# EAGLE design grillupboard (EAGLE 6.3)
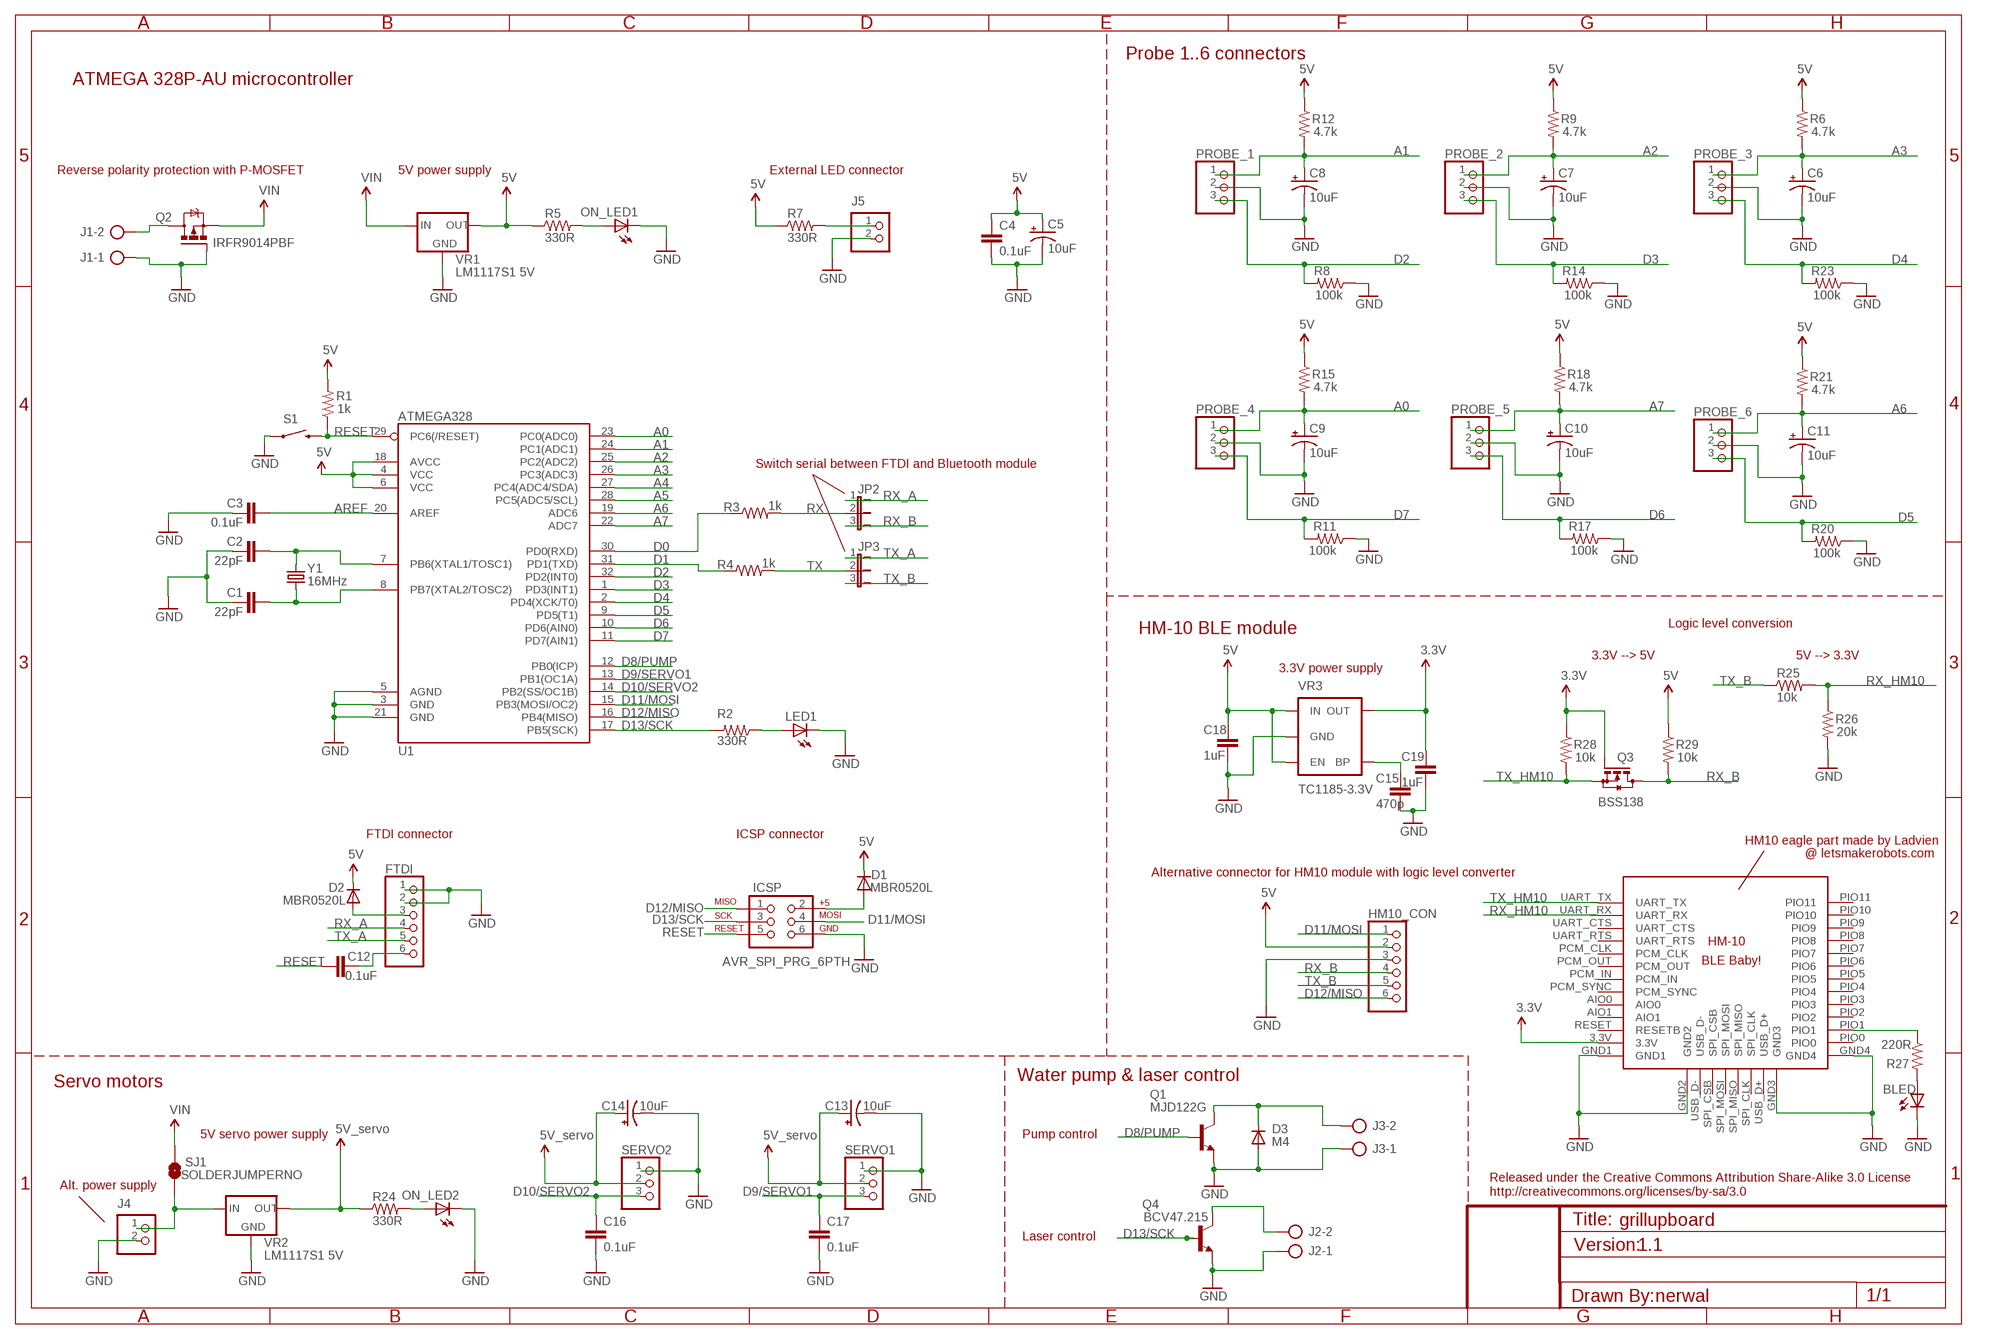
[diagram p0: schematic, sheet 1]

## Parts
BLED  LED0603  [LED-0603]
C1  22pF  CAP0805  [0805]
C2  22pF  CAP0805  [0805]
C3  0.1uF  CAP0805  [0805]
C4  0.1uF  CAP0805  [0805]
C5  10uF  CAP_POL1206  [EIA3216]
C6  10uF  CAP_POL1206  [EIA3216]
C7  10uF  CAP_POL1206  [EIA3216]
C8  10uF  CAP_POL1206  [EIA3216]
C9  10uF  CAP_POL1206  [EIA3216]
C10  10uF  CAP_POL1206  [EIA3216]
C11  10uF  CAP_POL1206  [EIA3216]
C12  0.1uF  CAP0805  [0805]
C13  10uF  CAP_POL1206  [EIA3216]
C14  10uF  CAP_POL1206  [EIA3216]
C15  470p  CAP0805  [0805]
C16  0.1uF  CAP0805  [0805]
C17  0.1uF  CAP0805  [0805]
C18  1uF  CAP0805  [0805]
C19  1uF  CAP0805  [0805]
D1  MBR0520L  MBR0520LT  [SOD123]
D2  MBR0520L  MBR0520LT  [SOD123]
D3  M4  DIODESMA  [SMA-DIODE]
FTDI  PINHD-1X6  [1X06]
HM10  RANDOM_PARTS_BLE-HM-10  [RANDOM_PARTS_BLE-HM-10]
HM10_CON  PINHD-1X6  [1X06]
ICSP  AVR_SPI_PRG_6PTH  [2X3]
J1  AK500/2-H  [AK500/2-H]
J2  AK500/2-H  [AK500/2-H]
J3  AK500/2-H  [AK500/2-H]
J4  PINHD-1X2  [1X02]
J5  PINHD-1X2  [1X02]
JP2  JP2E  [JP2]
JP3  JP2E  [JP2]
LED1  LED0603  [LED-0603]
ON_LED1  LED0603  [LED-0603]
ON_LED2  LED0603  [LED-0603]
PROBE_1  PINHD-1X3  [1X03]
PROBE_2  PINHD-1X3  [1X03]
PROBE_3  PINHD-1X3  [1X03]
PROBE_4  PINHD-1X3  [1X03]
PROBE_5  PINHD-1X3  [1X03]
PROBE_6  PINHD-1X3  [1X03]
Q1  MJD122G  MJD31  [DPAK]
Q2  IRFR9014PBF  IRFR5305  [D-PAK_TO252AA]
Q3  BSS138  BSS123  [SOT23]
Q4  BCV47.215  BCV71-NPN-SOT23-BEC  [SOT23-BEC]
R1  1k  RESISTOR0805-RES  [0805]
R2  330R  RESISTOR0805-RES  [0805]
R3  1k  RESISTOR0805-RES  [0805]
R4  1k  RESISTOR0805-RES  [0805]
R5  330R  RESISTOR0805-RES  [0805]
R6  4.7k  RESISTOR0805-RES  [0805]
R7  330R  RESISTOR0805-RES  [0805]
R8  100k  RESISTOR0805-RES  [0805]
R9  4.7k  RESISTOR0805-RES  [0805]
R11  100k  RESISTOR0805-RES  [0805]
R12  4.7k  RESISTOR0805-RES  [0805]
R14  100k  RESISTOR0805-RES  [0805]
R15  4.7k  RESISTOR0805-RES  [0805]
R17  100k  RESISTOR0805-RES  [0805]
R18  4.7k  RESISTOR0805-RES  [0805]
R20  100k  RESISTOR0805-RES  [0805]
R21  4.7k  RESISTOR0805-RES  [0805]
R23  100k  RESISTOR0805-RES  [0805]
R24  330R  RESISTOR0805-RES  [0805]
R25  10k  RESISTOR0805-RES  [0805]
R26  20k  RESISTOR0805-RES  [0805]
R27  220R  RESISTOR0805-RES  [0805]
R28  10k  RESISTOR0805-RES  [0805]
R29  10k  RESISTOR0805-RES  [0805]
S1  SWITCH-MOMENTARY-2-SMD-1101NE  [TACTILE-SWITCH-1101NE]
SERVO1  PINHD-1X3  [1X03]
SERVO2  PINHD-1X3  [1X03]
SJ1  SOLDERJUMPERNO  [SJ_2S-NO]
U1  ATMEGA328  ATMEGA168  [TQFP32-08]
VR1  LM1117S1 5V  LM1117  [SOT223]
VR2  LM1117S1 5V  LM1117  [SOT223]
VR3  TC1185-3.3V  V_REG_LDOSMD  [SOT23-5]
Y1  16MHz  CRYSTALHC49S  [HC49/S]

## Nets
3.3V: C19.1 HM10.3.3V Q3.1(G) R28.1 VR3.5(OUT)
5V: C4.1 C5.A(+) C18.1 D1.C D2.C HM10_CON.2 R1.2 R5.1 R6.1 R7.1 R9.1 R12.1 R15.1 R18.1 R21.1 R29.1 U1.4(VCC) U1.6(VCC) U1.18(AVCC) VR1.2(OUT) VR3.1(IN) VR3.3(EN)
A0: C9.A(+) PROBE_4.1 R15.2 U1.23(PC0(ADC0))
A1: C8.A(+) PROBE_1.1 R12.2 U1.24(PC1(ADC1))
A2: C7.A(+) PROBE_2.1 R9.2 U1.25(PC2(ADC2))
A3: C6.A(+) PROBE_3.1 R6.2 U1.26(PC3(ADC3))
A4: U1.27(PC4(ADC4/SDA))
A5: U1.28(PC5(ADC5/SCL))
A6: C11.A(+) PROBE_6.1 R21.2 U1.19(ADC6)
A7: C10.A(+) PROBE_5.1 R18.2 U1.22(ADC7)
AREF: C3.2 U1.20(AREF)
D0: R3.1 U1.30(PD0(RXD))
D1: R4.1 U1.31(PD1(TXD))
D2: PROBE_1.3 R8.2 U1.32(PD2(INT0))
D3: PROBE_2.3 R14.2 U1.1(PD3(INT1))
D4: PROBE_3.3 R23.2 U1.2(PD4(XCK/T0))
D5: PROBE_6.3 R20.2 U1.9(PD5(T1))
D6: PROBE_5.3 R17.2 U1.10(PD6(AIN0))
D7: PROBE_4.3 R11.2 U1.11(PD7(AIN1))
D8/PUMP: Q1.1(B) U1.12(PB0(ICP))
D9/SERVO1: C17.1 SERVO1.3 U1.13(PB1(OC1A))
D10/SERVO2: C16.1 SERVO2.3 U1.14(PB2(SS/OC1B))
D11/MOSI: HM10_CON.1 ICSP.4 U1.15(PB3(MOSI/OC2))
D12/MISO: HM10_CON.6 ICSP.1 U1.16(PB4(MISO))
D13/SCK: ICSP.3 Q4.B R2.2 U1.17(PB5(SCK))
GND: BLED.C C1.1 C2.1 C3.1 C4.2 C5.C(-) C6.C(-) C7.C(-) C8.C(-) C9.C(-) C10.C(-) C11.C(-) C13.C(-) C14.C(-) C15.2 C16.2 C17.2 C18.2 C19.2 D3.A FTDI.1 FTDI.2 HM10.GND1 HM10.GND2 HM10.GND3 HM10.GND4 HM10_CON.3 ICSP.6 J1.1 J2.1 J3.1 J4.2 J5.2 LED1.C ON_LED1.C ON_LED2.C PROBE_1.2 PROBE_2.2 PROBE_3.2 PROBE_4.2 PROBE_5.2 PROBE_6.2 Q1.3(E) Q2.1(G) Q4.E R8.1 R11.1 R14.1 R17.1 R20.1 R23.1 R26.2 S1.P$1 SERVO1.1 SERVO2.1 U1.3(GND) U1.5(AGND) U1.21(GND) VR1.1(GND) VR2.1(GND) VR3.2(GND)
N$1: C2.2 U1.7(PB6(XTAL1/TOSC1)) Y1.2
N$2: C1.2 U1.8(PB7(XTAL2/TOSC2)) Y1.1
N$3: ON_LED1.A R5.2
N$4: D1.A ICSP.2
N$5: LED1.A R2.1
N$6: ON_LED2.A R24.2
N$8: D3.C J3.2 Q1.4(C)
N$9: D2.A FTDI.3
N$10: J1.2 Q2.4(D)
N$11: J4.1 SJ1.1 VR2.3(IN)
N$12: C12.2 FTDI.6
N$13: J2.2 Q4.C
N$15: HM10.PIO1 R27.1
N$16: BLED.A R27.2
N$17: C15.1 VR3.4(BP)
N$19: J5.1 R7.2
RESET: C12.1 ICSP.5 R1.1 S1.P$2 U1.29(PC6(/RESET))
RX: JP2.2 R3.2
RX_A: FTDI.4 JP2.1
RX_B: HM10_CON.4 JP2.3 Q3.3(D) R29.2
RX_HM10: HM10.UART_RX R25.2 R26.1
TX: JP3.2 R4.2
TX_A: FTDI.5 JP3.1
TX_B: HM10_CON.5 JP3.3 R25.1
TX_HM10: HM10.UART_TX Q3.2(S) R28.2
VCC: C13.A(+) C14.A(+) R24.1 SERVO1.2 SERVO2.2 VR2.2(OUT) ; supply symbol labelled 5V_servo
VIN: Q2.3(S) SJ1.2 VR1.3(IN)
Unconnected: HM10.AIO0 HM10.AIO1 HM10.PCM_CLK HM10.PCM_IN HM10.PCM_OUT HM10.PCM_SYNC HM10.PIO0 HM10.PIO2 HM10.PIO3 HM10.PIO4 HM10.PIO5 HM10.PIO6 HM10.PIO7 HM10.PIO8 HM10.PIO9 HM10.PIO10 HM10.PIO11 HM10.RESET(RESETB) HM10.SPI_CLK HM10.SPI_CSB HM10.SPI_MISO HM10.SPI_MOSI HM10.UART_CTS HM10.UART_RTS HM10.USB_D+ HM10.USB_D-

## Notes on the sheet
- Probe 1..6 connectors
- ATMEGA 328P-AU microcontroller
- Reverse polarity protection with P-MOSFET | 5V power supply | External LED connector
- Switch serial between FTDI and Bluetooth module
- Logic level conversion
- HM-10 BLE module
- 3.3V --> 5V | 5V --> 3.3V
- 3.3V power supply
- FTDI connector | ICSP connector
- HM10 eagle part made by Ladvien
- @ letsmakerobots.com
- Alternative connector for HM10 module with logic level converter
- Water pump & laser control
- Servo motors
- 5V servo power supply | Pump control
- Released under the Creative Commons Attribution Share-Alike 3.0 License
- Alt. power supply
- http://creativecommons.org/licenses/by-sa/3.0
- Laser control
- 1.1
- nerwal

## Library data of the parts
BLED LED1 ON_LED1 ON_LED2 = SparkFun-LED:LED: LEDs Standard schematic elements and footprints for 5mm, 3mm, 1206, and 0603 sized LEDs. 5mm - Spark Fun Electronics SKU : COM-00529 (and others)
C1-C4 C12 C15-C19 = SparkFun-Passives:CAP: Capacitor Standard 0603 ceramic capacitor, and 0.1" leaded capacitor.
C5-C11 C13 C14 = SparkFun-Passives:CAP_POL: Capacitor Polarized These are standard SMD and PTH capacitors. Normally 10uF, 47uF, and 100uF in electrolytic and tantalum varieties. Always verify the external diameter of the through hole cap, it varies with capacity, voltage, and manufacturer. The EIA devices should be standard.
D1 D2 = diode:MBR0520LT: SCHOTTKY BARRIER RECTIFIER Source: http://onsemi.com .. MBR0520LT1-D.pdf
D3 = SparkFun-DiscreteSemi:DIODE: Diode These are standard reverse protection diodes and small signal diodes. SMA package can handle up to about 1A. SOD-323 can handle about 200mA. What the SOD-323 package when ordering, there are some mfgs out there that are 5-pin packages.
FTDI HM10_CON = pinhead:PINHD-1X6: PIN HEADER
HM10 = BLE_--_HM-10_--_Breakout_v0.9.9:RANDOM_PARTS_BLE-HM-10
ICSP = SparkFun-Connectors:AVR_SPI_PRG_6: AVR ISP 6 Pin This is the reduced ISP connector for AVR programming. Common on Arduino. This footprint will take up less PCB space and can be used with a 10-pin to 6-pin adapter such as SKU: BOB-08508
J1-J3 = con-ptr500:AK500/2-H: CONNECTOR Aug. 2004 / PTR Meßtechnik: Die Bezeichnung der Serie AK505 wurde geändert. Es handelt sich hierbei um AK500 in horizontaler Ausführung.; OC_FARNELL: unknown; OC_NEWARK: unknown
J4 J5 = pinhead:PINHD-1X2: PIN HEADER
JP2 JP3 = jumper:JP2E: JUMPER
PROBE_1-PROBE_6 SERVO1 SERVO2 = pinhead:PINHD-1X3: PIN HEADER
Q1 = transistor:MJD31*: Complementary Power Transistors
Q2 = transistor-power:IRF?5305: HEXFET Power MOSFET Source: http://www.irf.com/product-info/datasheets/data/irfr5305pbf.pdf
Q3 = transistor-small-signal:BSS123: N-CHANNEL MOS FET
Q4 = transistor:*-NPN-: NPN Transistror BF959 corrected 2008.03.06
R1-R9 R11 R12 R14 R15 R17 R18 R20 R21 R23-R29 = SparkFun-Passives:RESISTOR: Resistor Basic schematic elements and footprints for 0603, 1206, and PTH resistors.
S1 = SparkFun-Electromechanical:SWITCH-MOMENTARY-2: Various NO switches- pushbuttons, reed, etc
SJ1 = SparkFun-Passives:SOLDERJUMPER: Solder Jumper Standard SMD solder jumper. Used to automate production. Two varients : Normally Open and Normally Closed are the same, but have different paste layers. NC will have a large amount of paste and should jumper during reflow.
U1 = SparkFun-DigitalIC:ATMEGA168: Atmel 32-pin 8-bit micro, 16k flash.
VR1 VR2 = v-reg-3:LM1117
VR3 = SparkFun-PowerIC:V_REG_LDO: Voltage Regulator LDO Standard 150mA LDO voltage regulator in SOT-23 layout. Micrel part MIC5205. BP (by-pass) pin is used to lower output noise with 470pF cap.
Y1 = crystal:CRYSTAL: CRYSTAL; OC_FARNELL: 1667008; OC_NEWARK: unknown

## Board
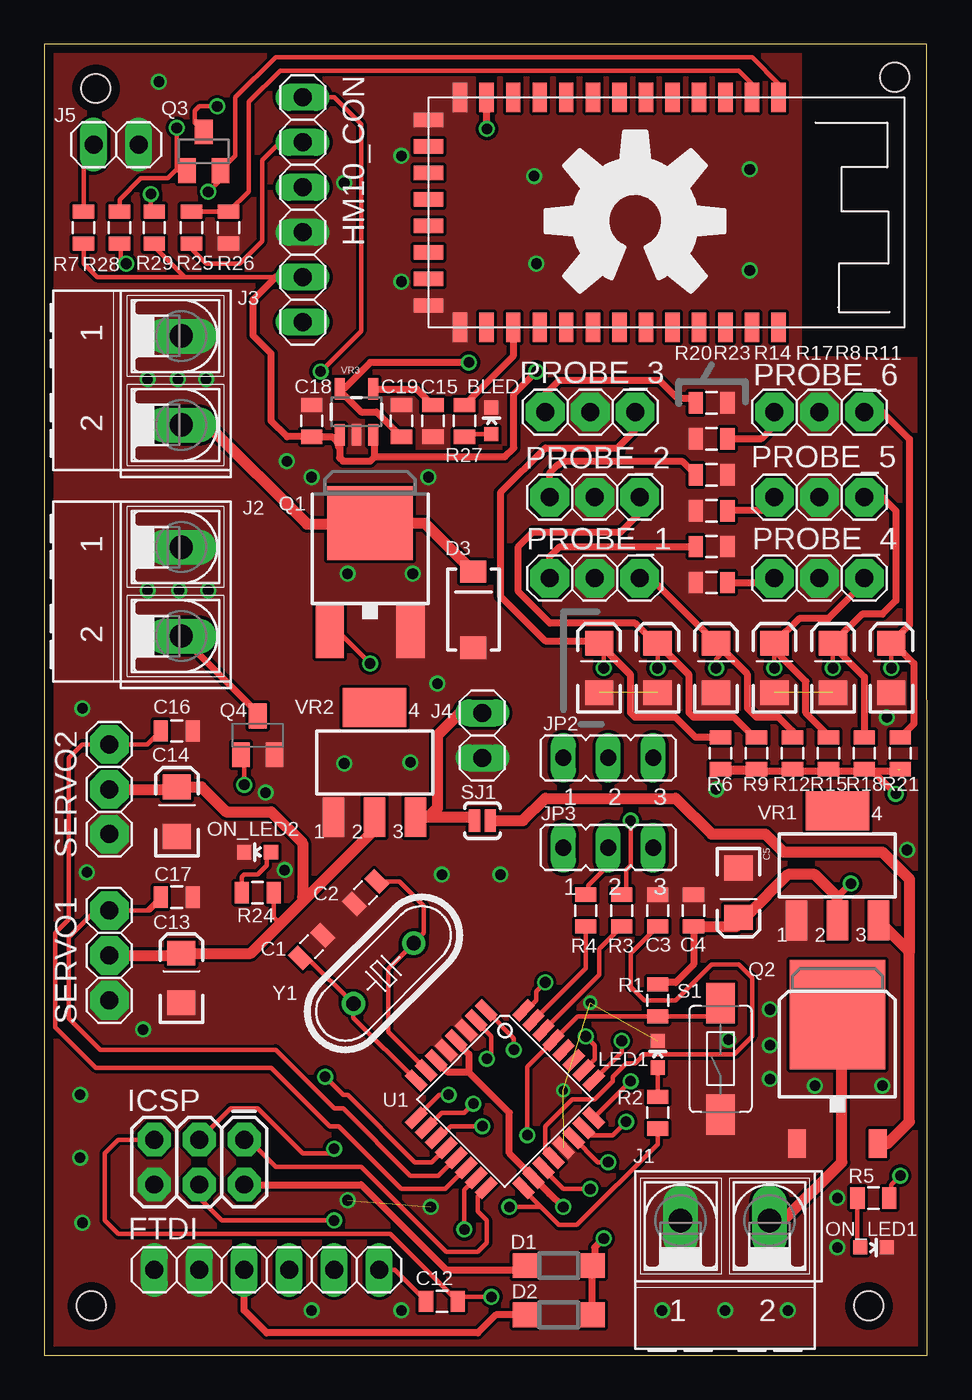
[diagram p1: board, top side]
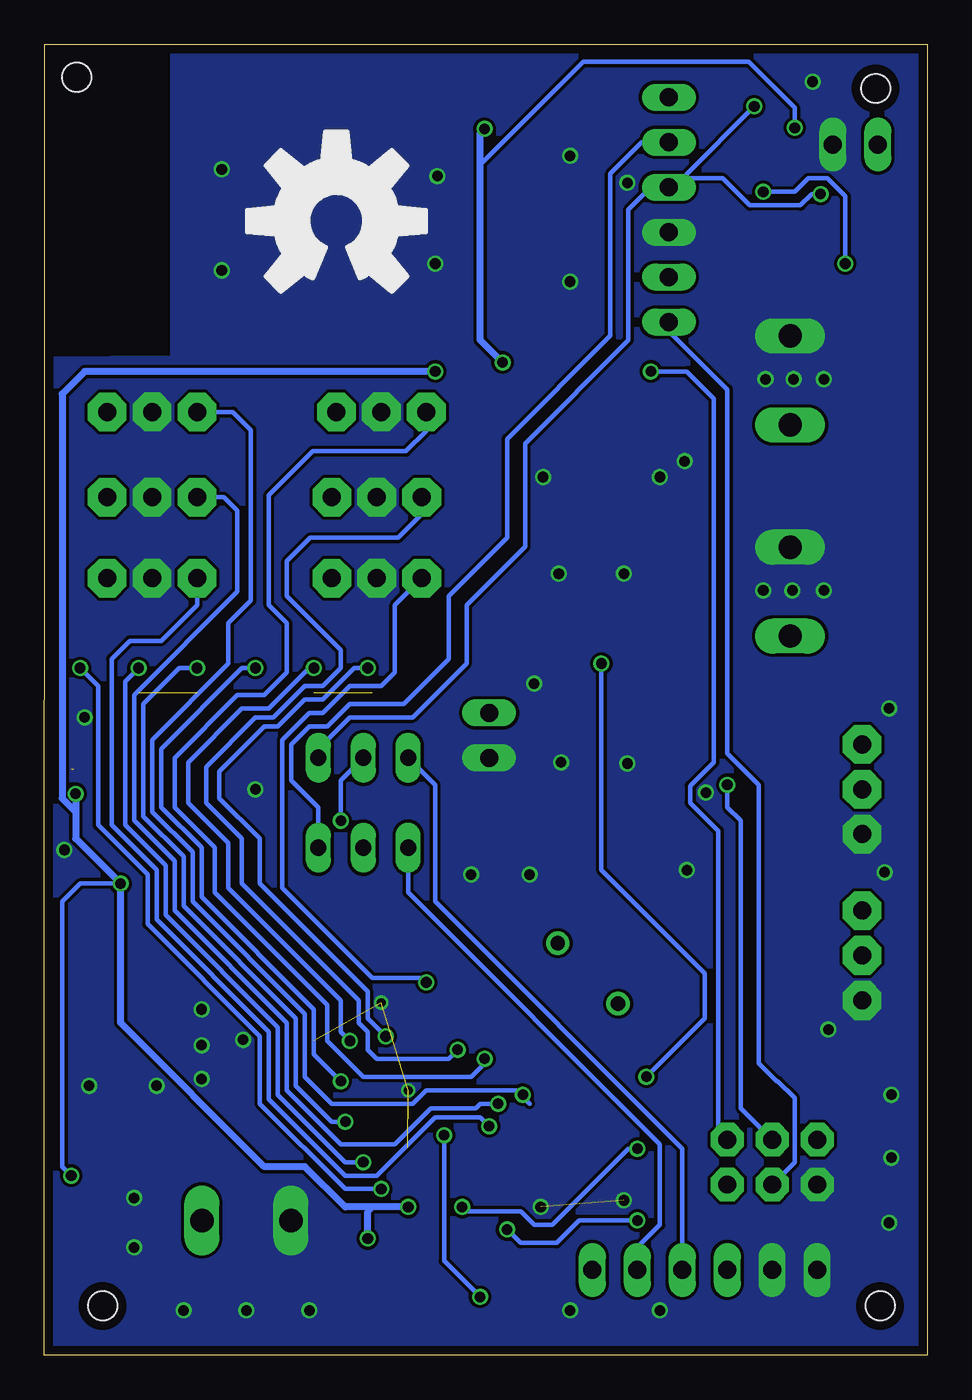
[diagram p2: board, bottom side, seen from below]

Size 49.91 x 74.13 mm. Coordinates in mm from the lower left corner, seen from the top.
Outline: 0,0 49.91,0 49.89,74.13 0,74.13 0,0
Copper layers (1*16): Top 0.035mm / dielectric 1.5mm / Bottom 0.035mm
Design rules: minimum track width 7mil, minimum drill 12mil, track to track 7mil, track to pad 7mil, pad to pad 7mil, via to via 7mil, smd to smd 0mil, copper to edge 20mil, drill to drill 10mil, minimum pad ring 10mil, minimum via ring 6mil, stop-mask expansion 2mil, vias tented up to drill 25mil, thermal gap 10mil
Holes 1.65 mm at 2.67,2.79 46.61,2.79 2.92,71.63 48.07,72.26
tRestrict: area 1.5,1.7 to 3.8,3.9; area 45.5,1.7 to 47.8,3.9; area 1.8,70.5 to 4.1,72.8; area 46.9,71.1 to 49.2,73.4
bRestrict: area 1.5,1.7 to 3.8,3.9; area 45.5,1.7 to 47.8,3.9; area 1.8,70.5 to 4.1,72.8; area 46.9,71.1 to 49.2,73.4

### Footprints (pad centres in the part's own frame; a part is rotated, then mirrored left to right if it is on the bottom)
LED-0603 = smd 0.8 x 0.8: A 0,-0.75; C 0,0.75
0805 = smd 0.8 x 1.2: 1 -0.9,0; 2 0.9,0
EIA3216 = smd 1.4 x 1.6: A 1.4,0; C -1.4,0
SOD123 = smd 1.4 x 1.4: A 1.9,0; C -1.9,0
SMA-DIODE = smd 1.27 x 1.47: A -2.15,0; C 2.15,0
1X06 = drill 1.016 long: 1 -6.35,0; 2 -3.81,0; 3 -1.27,0; 4 1.27,0; 5 3.81,0; 6 6.35,0
RANDOM_PARTS_BLE-HM-10 = smd 1.676 x 0.813: 3.3V 0,3.29; AIO0 0,7.79; AIO1 0,6.29; GND1 0,1.79; GND4 13,1.79; PCM_CLK 0,13.79; PCM_IN 0,10.79; PCM_OUT 0,12.29; PCM_SYNC 0,9.29; PIO0 13,3.29; PIO1 13,4.79; PIO2 13,6.29; PIO3 13,7.79; PIO4 13,9.29; PIO5 13,10.79; PIO6 13,12.29; PIO7 13,13.79; PIO8 13,15.29; PIO9 13,16.79; PIO10 13,18.29; PIO11 13,19.79; RESET 0,4.79; UART_CTS 0,16.79; UART_RTS 0,15.29; UART_RX 0,18.29; UART_TX 0,19.79 | smd 0.813 x 1.676: GND2 1.27,0; GND3 11.77,0; SPI_CLK 8.77,0; SPI_CSB 4.27,0; SPI_MISO 7.27,0; SPI_MOSI 5.77,0; USB_D+ 10.27,0; USB_D- 2.77,0
2X3 = drill 1.016 pad 1.88 octagon: 1 0,0; 2 0,2.54; 3 2.54,0; 4 2.54,2.54; 5 5.08,0; 6 5.08,2.54
AK500/2-H = drill 1.321 long: 1 -2.515,0; 2 2.515,0
1X02 = drill 1.016 long: 1 -1.27,0; 2 1.27,0
JP2 = drill 0.914 long: 1 -2.54,0; 2 0,0; 3 2.54,0
1X03 = drill 1.016 pad 2.184 octagon: 1 -2.54,0; 2 0,0; 3 2.54,0
DPAK = smd 1.6 x 3: 1 -2.28,-4.04; 3 2.28,-4.04 | smd 4.826 x 4.191: 4 0,2.096
D-PAK_TO252AA = smd 1 x 1.6: 1 -2.28,-4.8; 3 2.28,-4.8 | smd 5.4 x 6.2: 4 0,2.5
SOT23 = smd 1 x 1.4: 1 -0.95,-1.1; 2 0.95,-1.1; 3 0,1.1
SOT23-BEC = smd 1 x 1.4: B -0.95,-1.1; C 0,1.1; E 0.95,-1.1
TACTILE-SWITCH-1101NE = smd 2.3 x 1.6: P$1 -3.15,0; P$2 3.15,0
SJ_2S-NO = smd 0.635 x 1.27: 1 -0.45,0; 2 0.45,0
TQFP32-08 = smd 1.27 x 0.559: 1 -4.293,2.8; 2 -4.293,2; 3 -4.293,1.2; 4 -4.293,0.4; 5 -4.293,-0.4; 6 -4.293,-1.2; 7 -4.293,-2; 8 -4.293,-2.8; 17 4.293,-2.8; 18 4.293,-2; 19 4.293,-1.2; 20 4.293,-0.4; 21 4.293,0.4; 22 4.293,1.2; 23 4.293,2; 24 4.293,2.8 | smd 0.559 x 1.27: 9 -2.8,-4.293; 10 -2,-4.293; 11 -1.2,-4.293; 12 -0.4,-4.293; 13 0.4,-4.293; 14 1.2,-4.293; 15 2,-4.293; 16 2.8,-4.293; 25 2.8,4.293; 26 2,4.293; 27 1.2,4.293; 28 0.4,4.293; 29 -0.4,4.293; 30 -1.2,4.293; 31 -2,4.293; 32 -2.8,4.293
SOT223 = smd 1.219 x 2.235: 1 -2.311,-3.099; 2 0,-3.099; 3 2.311,-3.099 | smd 3.6 x 2.2: 4 0,3.099
SOT23-5 = smd 0.55 x 1.2: 1 -0.95,-1.3; 2 0,-1.3; 3 0.95,-1.3; 4 0.95,1.3; 5 -0.95,1.3
HC49/S = drill 0.813: 1 -2.413,0; 2 2.413,0

### Placement (x,y rotation side)
BLED  25.27,52.83 0 top
C1  15.11,23.11 225 top
C2  18.16,26.16 45 top
C3  34.67,25.15 270 top
C4  36.7,25.15 90 top
C5  39.24,26.16 270 top
C6  31.37,38.86 90 top
C7  34.67,38.86 90 top
C8  37.97,38.86 90 top
C9  41.27,38.86 90 top
C10  44.58,38.86 90 top
C11  47.88,38.86 90 top
C12  22.48,3.05 180 top
C13  7.75,21.34 90 top
C14  7.49,30.73 90 top
C15  21.97,52.83 270 top
C16  7.49,35.31 0 top
C17  7.49,25.91 0 top
C18  15.11,52.83 90 top
C19  20.19,52.83 90 top
D1  29.08,5.08 180 top
D2  29.08,2.29 180 top
D3  24.26,42.16 90 top
FTDI  12.57,4.83 0 top
HM10  21.72,71.12 270 top
HM10_CON  14.6,64.77 90 top
ICSP  11.3,12.19 180 top
J1  38.48,7.62 0 top
J2  7.75,43.18 270 top
J3  7.75,55.12 270 top
J4  24.77,35.05 270 top
J5  4.06,68.45 0 top
JP2  31.88,33.78 0 top
JP3  31.88,28.7 0 top
LED1  34.67,17.02 0 top
ON_LED1  46.86,6.1 270 top
ON_LED2  12.06,28.45 90 top
PROBE_1  31.12,43.94 180 top
PROBE_2  31.12,48.51 180 top
PROBE_3  30.86,53.34 180 top
PROBE_4  43.81,43.94 180 top
PROBE_5  43.81,48.51 180 top
PROBE_6  43.81,53.34 180 top
Q1  18.42,44.96 0 top
Q2  44.83,16.76 0 top
Q3  9.02,68.07 0 top
Q4  12.06,35.05 0 top
R1  34.67,20.07 90 top
R2  34.67,13.72 270 top
R3  32.64,25.15 90 top
R4  30.61,25.15 90 top
R5  46.86,8.89 180 top
R6  38.23,34.04 90 top
R7  2.22,63.75 90 top
R8  37.72,45.72 180 top
R9  40.26,34.04 90 top
R11  37.72,43.69 0 top
R12  42.29,34.04 90 top
R14  37.72,49.78 180 top
R15  44.32,34.04 90 top
R17  37.72,47.75 0 top
R18  46.35,34.04 90 top
R20  37.72,51.82 0 top
R21  48.39,34.04 90 top
R23  37.72,53.85 180 top
R24  12.06,26.16 180 top
R25  8.32,63.75 90 top
R26  10.41,63.75 270 top
R27  23.75,52.83 270 top
R28  4.25,63.75 270 top
R29  6.22,63.75 90 top
S1  38.23,16.76 90 top
SERVO1  3.68,22.61 90 top
SERVO2  3.68,32 90 top
SJ1  24.77,30.23 0 top
U1  26.04,14.48 315 top
VR1  44.83,27.69 0 top
VR2  18.67,33.53 0 top
VR3  17.65,53.34 0 top
Y1  19.18,21.59 45 top

### Tracks (layer width: path | path; a pad name or v marks a point on that pad's centre or on a via)
3.3V  (via drill 0.6)
  Top 0.254: Q3.1 7.58,66.97 7.49,67.06 | 7.49,67.06 v7.49,69.41 | R28.1 4.25,65.34 5.46,66.55 6.99,66.55 7.49,67.06
  Top 0.406: v25.02,69.34 25.02,71.11 HM10.3.3V | v24,56.13 18.42,56.13 16.92,54.64 VR3.5 | 16.64,54.71 VR3.5 | C19.1 18.79,53.34 17.91,53.34 16.7,54.54 VR3.5
  Bottom 0.254: 25.27,67.31 19.43,73.15 10.1,73.15 7.49,70.55 v7.49,69.41
  Bottom 0.406: v25.02,69.34 25.27,69.09 25.27,67.31 25.27,57.4 v24,56.13
5V  (via drill 0.6)  (1 unrouted)
  Top 0.254: v48.39,10.16 47.88,9.65 47.88,9.01 R5.1 | R29.1 6.35,62.55 7.94,60.96 | 13.59,60.96 HM10_CON.2 7.94,60.96 | R7.1 2.22,61.72 2.98,60.96 7.94,60.96
  Top 0.406: 44.83,25.91 v45.59,26.67 | C4.1 36.7,22.1 35.69,21.08 34.79,21.08 R1.2 | 22.15,16.58 U1.6 22.81,16 24,16 | U1.4 23.28,17.74 24,17.02 24,16 | D2.C D1.C 31.12,5.21 31.12,6.1 v31.62,6.6 | VR3.1 16.7,51.31 | 16.7,51.31 16.7,50.73 16.89,50.55 18.42,50.55 18.67,50.8 | 18.67,50.8 18.67,51.97 VR3.3 | 16.7,51.31 16.64,51.37 16.64,51.56 16.27,51.93 C18.1 13.73,51.93 12.83,52.83 12.83,56.64 11.81,57.66 11.81,59.69 13.08,60.96 HM10_CON.2 | v29.34,8.38 28.54,9.14 U1.18 27.3,10.38 27.3,10.41 26.29,11.43 26.29,13.72 24,16 | 48.25,33.14 48.13,33.02 46.86,33.02 | 46.86,33.02 v48.13,31.75 | 46.86,33.02 46.47,33.02 R18.1 46.22,33.14 46.1,33.02 44.44,33.02 R15.1 44.32,33.02 42.41,33.02 | 42.41,33.02 38.34,33.02 R6.1 R9.1 | 42.41,33.02 R12.1 | 18.67,50.8 26.04,50.8 26.54,51.31 26.54,54.36 v27.81,55.63
  Top 0.61: VR1.2 44.83,25.91 43.56,27.18 42.04,27.18 39.75,24.89 | 39.75,24.89 39.37,24.89 C5.A | C4.1 39.1,24.25 39.75,24.89
  Bottom 0.254: v45.59,26.67 47.88,26.67 48.89,25.65 48.89,10.67 v48.39,10.16
  Bottom 0.406: v29.34,8.38 31.37,8.38 | v31.62,6.6 31.62,8.13 31.37,8.38 | v48.13,31.75 48.13,30.73 | 48.13,30.73 48.13,29.21 v45.59,26.67 45.59,18.8 37.46,10.67 35.18,10.67 32.89,8.38 31.37,8.38 | v27.81,55.63 47.62,55.63 48.89,54.36 48.89,31.5 48.13,30.73
A0  (via drill 0.6)
  Top 0.254: 41.27,39.88 v41.27,38.86 | v32.89,13.21 32.13,12.45 30.89,12.45 U1.23
  Top 0.406: PROBE_4.1 46.35,43.69 44.32,41.66 42.67,41.66 C9.A 41.27,39.88 43.05,38.1 43.05,36.32 44.32,35.05 R15.2
  Bottom 0.254: v41.27,38.86 42.29,38.86 44.32,36.83 44.32,30.48 42.04,28.19 42.04,25.4 35.69,19.05 35.69,15.24 33.65,13.21 v32.89,13.21
A1  (via drill 0.6)
  Top 0.254: 31.05,13.65 U1.24 33.12,15.49 v33.15,15.49 | 39.75,36.58 39.75,38.61 38.48,39.88 38.42,39.82 37.97,39.37 v37.97,38.86
  Top 0.406: R12.2 42.29,35.31 41.53,36.07 40.26,36.07 39.75,36.58 39.75,38.48 38.42,39.82 C8.A 36.07,42.16 34.29,43.94 PROBE_1.1
  Bottom 0.254: v37.97,38.86 38.73,38.86 43.31,34.29 43.31,30.99 41.02,28.7 41.02,25.91 34.67,19.56 34.67,17.02 v33.15,15.49
A2  (via drill 0.6)
  Top 0.254: 34.67,40.13 C7.A | 36.45,36.32 36.45,38.35 34.67,40.13 | 34.67,40.13 v34.67,38.86 | v32.64,17.78 32.64,17.12 U1.25
  Top 0.406: R9.2 40.12,34.94 38.99,36.07 36.7,36.07 36.45,36.32 36.45,38.48 C7.A 34.54,40.26 33.4,41.4 28.58,41.4 26.8,43.18 26.8,45.72 27.62,46.55 32.58,46.55 33.65,47.62 PROBE_2.1
  Bottom 0.254: v32.64,17.78 33.15,18.29 33.15,20.07 39.5,26.42 39.5,28.96 41.78,31.24 41.78,33.53 38.73,36.58 37.21,36.58 34.92,38.86 v34.67,38.86
A3  (via drill 0.6)
  Top 0.254: 30.48,16.13 U1.26 31.12,16.73 31.12,17.53 v30.61,18.03 | 30.86,40.39 31.62,39.62 v31.62,38.86 31.62,39.88 33.15,38.35 33.15,36.32
  Top 0.406: R6.2 36.82,34.94 35.69,36.07 33.4,36.07 33.15,36.32 33.15,38.48 C6.A 31.25,40.39 30.86,40.39 28.32,40.39 25.78,42.93 25.78,48.77 28.32,51.31 32.38,51.31 33.4,52.32 PROBE_3.1
  Bottom 0.254: v30.61,18.03 31.62,19.05 31.62,20.57 37.72,26.67 37.72,29.21 40,31.5 40,33.02 37.46,35.56 36.7,35.56 35.18,37.08 34.16,37.08 32.38,38.86 v31.62,38.86
A6  (via drill 0.6)
  Top 0.254: U1.19 28.22,10.51 29.34,9.4 v30.86,9.4 | v47.88,38.86 C11.A
  Top 0.406: PROBE_6.1 47.37,53.34 48.89,51.82 48.89,41.28 C11.A 48,40.26 49.15,39.12 49.15,35.7 R21.2
  Bottom 0.254: v47.88,38.86 46.86,37.85 46.86,29.97 44.07,27.18 44.07,24.38 37.72,18.03 37.72,14.22 32.89,9.4 v30.86,9.4
A7  (via drill 0.6)
  Top 0.254: 30,12.29 U1.22 31.29,10.92 v31.88,10.92 | 44.58,40.13 v44.58,38.86
  Top 0.406: PROBE_5.1 47.37,48.51 48.13,47.75 48.13,42.67 47.37,41.91 46.22,41.91 C10.A 44.58,40.13 46.35,38.35 R18.2
  Bottom 0.254: v44.58,38.86 45.34,38.1 45.34,29.97 43.05,27.69 43.05,24.89 36.7,18.54 36.7,14.73 32.89,10.92 v31.88,10.92
AREF
  Top 0.254: 28.85,11.16 U1.20 28.59,11.16 28.32,11.43 28.32,12.95 29.85,14.48 31.12,14.48 32.13,15.49 32.13,15.75 32.89,16.51 33.4,16.51 33.91,17.02 38.99,17.02 40,18.03 40,21.34 39.24,22.1 37.72,22.1 35.69,20.07 33.91,20.07 33.15,20.83 33.15,22.72 C3.2
D0
  Top 0.254: 32.25,24.25 R3.1 31.37,22.98 31.37,21.51 U1.30
D1
  Top 0.254: R4.1 30.61,21.88 U1.31
D2  (via drill 0.6)
  Top 0.254: U1.32 27.24,19.49 27.81,20.07 27.81,20.57 v28.32,21.08
  Top 0.406: PROBE_1.3 28.58,45.15 29.15,45.72 R8.2
  Bottom 0.254: v28.32,21.08 28.58,21.34 31.37,21.34 36.45,26.42 36.45,34.8 34.92,36.32 34.16,36.32 32.64,37.85 30.86,37.85 30.1,38.61 30.1,42.42 PROBE_1.3
D3  (via drill 0.6)
  Top 0.254: v26.54,17.27 26.54,17.93 U1.1
  Top 0.406: PROBE_2.3 28.58,49.91 29.02,50.35 29.08,50.35 29.27,50.55 36.06,50.55 R14.2
  Bottom 0.254: v26.54,17.27 27.05,16.76 31.12,16.76 31.62,17.27 31.62,18.29 32.13,18.8 32.13,20.07 38.73,26.67 38.73,29.21 40.77,31.24 40.77,33.27 37.97,36.07 36.96,36.07 35.18,37.85 34.16,37.85 33.15,38.86 33.15,39.88 36.2,42.93 36.2,44.9 34.86,46.23 29.91,46.23 28.58,47.56 PROBE_2.3
D4  (via drill 0.6)
  Top 0.254: U1.2 24.41,18.89 25.27,18.03 25.27,17.02 v25.02,16.76 | R23.2 36.56,54.1 36.7,54.1 36.82,53.99 R23.2
  Top 0.406: 36.56,54.1 35.81,54.1 34.8,55.12 29.08,55.12 28.26,54.29 28.26,53.4 PROBE_3.3
  Bottom 0.254: v25.02,16.76 25.02,16.51 25.78,15.75 31.88,15.75 33.91,17.78 33.91,19.81 40.26,26.16 40.26,28.7 42.54,30.99 42.54,33.78 38.99,37.34 37.46,37.34 36.2,38.61 36.2,41.4 37.21,42.42 37.21,48.64 34.73,51.12 29.46,51.12 28.32,52.26 PROBE_3.3
D5  (via drill 0.6)
  Top 0.254: v22.86,14.73 22.33,14.73 U1.9
  Top 0.406: PROBE_6.3 41.27,52.58 40.51,51.82 R20.2
  Bottom 0.254: v22.86,14.73 22.48,14.22 23.24,14.99 28.32,14.99 29.08,14.22 33.65,14.22 35.18,15.75 35.18,19.3 41.53,25.65 41.53,28.45 43.81,30.73 43.81,34.8 39.5,39.12 39.5,41.4 38.23,42.67 38.23,52.32 39.24,53.34 PROBE_6.3
D6  (via drill 0.6)
  Top 0.254: U1.10 21.62,12.86 22.48,13.72 23.75,13.72 v24.26,14.22
  Top 0.406: PROBE_5.3 41.27,48.01 41.02,47.75 R17.2
  Bottom 0.254: PROBE_5.3 39.75,48.51 38.99,47.75 38.99,43.18 44.83,37.34 44.83,30.23 42.54,27.94 42.54,25.15 36.2,18.8 36.2,14.99 33.15,11.94 30.1,11.94 28.07,13.97 25.53,13.97 25.27,14.22 v24.26,14.22
D7  (via drill 0.6)
  Top 0.254: U1.11 22.32,12.29 22.99,12.95 v24.77,12.95
  Top 0.406: R11.2 41.02,43.69 PROBE_4.3
  Bottom 0.254: v24.77,12.95 25.27,13.46 27.81,13.46 31.12,10.16 32.89,10.16 37.21,14.48 37.21,18.29 43.56,24.64 43.56,27.43 46.1,29.97 46.1,39.37 45.09,40.39 43.31,40.39 41.27,42.42 PROBE_4.3
D8/PUMP  (via drill 0.6)
  Top 0.254: Q1.1 16.61,40.92 v18.42,39.12 | U1.12 21.91,10.92 20.96,10.92 17.14,14.73 16.89,14.73 v15.87,15.75
  Bottom 0.254: v18.42,39.12 18.42,27.43 12.57,21.59 12.57,19.05 v15.87,15.75
D9/SERVO1
  Top 0.254: SERVO1.3 5.83,25.15 C17.1 6.59,25.77 5.97,25.15 SERVO1.3 | SERVO1.3 2.92,25.15 1.4,23.62 1.4,19.05 3.17,17.27 13.08,17.27 16.38,13.97 16.89,13.97 20.7,10.16 22.28,10.16 U1.13
D10/SERVO2
  Top 0.254: C16.1 5.83,34.54 SERVO2.3 2.16,34.54 1.4,33.78 1.4,24.64 0.64,23.88 0.64,18.54 2.92,16.26 12.83,16.26 16.13,12.95 16.64,12.95 20.19,9.4 22.65,9.4 U1.14
D11/MOSI  (via drill 0.6)
  Top 0.254: v23.75,7.11 23.75,9.36 U1.15 | ICSP.4 8.76,8.89 10.03,7.62 v16.38,7.62
  Bottom 0.254: HM10_CON.1 14.6,57.91 11.3,54.61 11.3,34.04 9.52,32.26 9.52,16.51 8.51,15.49 8.44,15.49 7.49,14.54 7.49,10.92 ICSP.4 | v23.75,7.11 22.99,6.35 20.96,6.35 19.69,7.62 v16.38,7.62
D12/MISO  (via drill 0.6)
  Top 0.254: 24.83,9.46 U1.16 24.51,8.99 24.51,8.13 25.02,7.62 25.02,6.35 24.51,5.84 22.73,5.84 17.91,10.67 13.08,10.67 11.56,12.19 ICSP.1 | HM10_CON.6 16.38,71.12 17.91,69.6 17.91,57.91 v15.62,55.63
  Bottom 0.254: v15.62,55.63 13.59,55.63 12.06,54.1 12.06,33.53 13.4,32.19 13.4,31.24 11.81,29.65 11.81,12.7 ICSP.1
D13/SCK  (via drill 0.6)
  Top 0.254: U1.17 27.09,9.36 28.07,8.38 | 28.07,8.38 29.08,7.37 30.1,7.37 34.67,11.94 R2.2 | v26.29,8.38 28.07,8.38 | Q4.B 11.3,33.95 v11.3,32.26 | ICSP.3 10.54,13.97 12.06,13.97 14.6,11.43 16.13,11.43 v16.38,11.68
  Bottom 0.254: v11.3,32.26 11.3,30.99 10.54,30.23 10.54,13.97 ICSP.3 | v16.38,11.68 16.89,11.68 21.21,7.37 22.23,7.37 22.99,8.13 26.04,8.13 v26.29,8.38
GND  (via drill 0.5, 0.6)  (6 unrouted)
  Top 0.406: 13.18,33.78 Q4.E
  other vias: 6.48,72.01 20.19,67.82 20.19,60.71 27.69,66.67 39.88,67.06 39.88,61.34 27.81,61.72 13.72,50.55 17.14,44.2 20.83,44.2 22.23,37.97 20.7,33.53 16.95,33.46 2.16,36.58 37.97,32 47.62,36.07 43.56,15.24 47.37,15.24 2.41,27.3 2.03,14.73 2.16,7.49 5.59,18.41 17.14,8.76 15.11,2.54 20.19,2.54 34.92,2.54 38.48,2.54 42.04,2.54 44.83,6.1 44.83,8.89 41.02,15.62 41.02,19.56 41.02,17.53 22.48,27.18 25.78,27.18 21.84,8.38 30.86,19.94 2.03,11.18 15.11,49.66 21.72,49.66 29.34,14.99 48.77,28.57 16.95,66.29 13.59,27.43 12.51,31.81 38.67,17.84 9.14,55.18 7.56,55.18 5.84,55.18 9.27,43.24 7.62,43.24 5.84,43.24
  pour Top (no thermals): 0,74.17 42.61,74.1 42.61,57.59 42.61,56.32 49.78,56.26 49.78,0.06 -0.13,0.13
  pour Bottom (no thermals): 0,74.17 42.61,74.1 42.61,57.59 42.61,56.32 49.78,56.26 49.78,0.06 -0.13,0.13
N$1
  Top 0.254: U1.7 21.59,16.13 19.43,18.29 19.43,21.84 Y1.2 21.46,23.88 21.46,25.4 20.07,26.8 C2.2
N$2
  Top 0.254: U1.8 17.47,19.08 Y1.1 14.88,22.48 C1.2
N$3
  Top 0.254: R5.2 45.96,6.25 ON_LED1.A
N$4
  Top 0.406: ICSP.2 17.91,9.65 22.73,4.83 26.93,4.83 D1.A
N$5
  Top 0.254: R2.1 LED1.A
N$6
  Top 0.254: R24.2 11.16,27.04 11.3,27.18 12.06,27.18 12.57,27.69 12.57,28.21 ON_LED2.A
N$8
  Top 0.61: D3.C 21.52,47.05 Q1.4 18.35,46.99 14.86,46.99 9.25,52.6 J3.2
N$9
  Top 0.406: D2.A 25.53,2.29 24.51,1.27 12.57,1.27 11.3,2.54 FTDI.3
N$10
  Top 0.61: J1.2 41.78,7.62 45.09,10.92 45.09,18.29 44.32,19.05 44.62,19.05 Q2.4
N$11
  Top 0.61: VR2.3 21.72,30.43 | 21.72,30.43 24.11,30.43 SJ1.1 | J4.1 23.5,36.32 22.23,35.05 22.23,30.94 21.72,30.43
N$12
  Top 0.254: FTDI.6 19.8,4.83 C12.2
N$13
  Top 0.406: Q4.C 12.06,36.32 7.75,40.64 J2.2
N$15
  Top 0.406: HM10.PIO1 26.51,56.49 R27.1
N$16
  Top 0.254: BLED.A 23.39,52.08 R27.2
N$17
  Top 0.406: VR3.4 21.06,54.64 C15.1
N$19
  Top 0.254: R7.2 2.22,67.88 J5.1
RESET  (via drill 0.6)
  Top 0.254: S1.P$2 37.48,19.17 R1.1 30.16,19.17 U1.29 | U1.29 28.79,17.74 | v25.27,3.3 23.63,3.3 C12.1 19.57,6.86 4.19,6.86 3.43,7.62 3.43,11.43 4.19,12.19 ICSP.5 | v27.3,12.45 27.3,16.31 U1.29
  Bottom 0.254: v27.3,12.45 27.3,5.33 v25.27,3.3
RX  (via drill 0.6)
  Top 0.254: R3.2 32.89,26.3 32.89,27.43 33.15,27.69 v33.15,30.23
  Bottom 0.254: v33.15,30.23 33.15,32.51 JP2.2
RX_A
  Bottom 0.254: FTDI.4 13.84,11.68 27.81,25.65 27.81,32.26 JP2.1
RX_B  (via drill 0.6)
  Top 0.254: v9.78,70.61 8.76,70.61 8.51,70.36 8.51,69.68 Q3.3 | R29.2 6.03,64.71 v6.03,65.66
  Bottom 0.254: 13.72,66.67 14.35,66.04 HM10_CON.4 15.62,66.04 16.89,64.77 16.89,57.4 22.73,51.56 22.73,45.72 26.04,42.42 26.04,39.12 29.08,36.07 32.64,36.07 34.42,34.29 JP2.3 | 13.72,66.67 v9.78,70.61 | 13.72,66.67 13.59,66.55 11.56,66.55 10.03,65.02 7.18,65.02 6.54,65.66 v6.03,65.66
RX_HM10
  Top 0.254: HM10.UART_RX 40,71.88 39.24,72.64 13.33,72.64 11.56,70.87 11.56,65.8 R26.1 R25.2
TX
  Top 0.254: R4.2 30.75,26.05 30.75,26.55 31.88,27.69 JP3.2
TX_A
  Bottom 0.254: FTDI.5 16.38,6.1 15.11,7.37 15.11,11.94 29.34,26.16 JP3.1
TX_B
  Top 0.254: R25.1 8.38,62.48 9.14,61.72 11.05,61.72 12.32,62.99 12.32,67.56 13.33,68.58 HM10_CON.5
  Bottom 0.254: HM10_CON.5 16.13,68.58 17.91,66.8 17.91,57.66 23.75,51.82 23.75,46.23 27.05,42.93 27.05,39.37 29.59,36.83 32.64,36.83 33.91,35.56 34.92,35.56 35.94,34.54 35.94,32.51 34.42,30.99 JP3.3
TX_HM10  (via drill 0.6)
  Top 0.254: Q3.2 9.97,67.24 | Q3.2 9.97,66.99 10.79,67.82 10.79,71.12 13.08,73.41 40,73.41 41.53,71.88 41.53,71.14 HM10.UART_TX | Q3.2 9.97,66.48 v9.27,65.79 | v4.64,61.72 4.32,62.04 4.32,62.79 R28.2
  Bottom 0.254: v9.27,65.79 7.49,65.79 6.73,66.55 5.65,66.55 4.64,65.53 v4.64,61.72
VCC
  Top 0.254: R24.1 12.96,24.75 13.33,24.38
  Top 0.61: SERVO1.2 7.62,22.61 C13.A 11.68,22.74 13.08,24.13 13.33,24.38 14.73,25.78 | VR2.2 18.67,29.72 14.73,25.78 | SERVO2.2 7.36,32 C14.A 8.89,32.13 10.29,30.73 12.83,30.73 14.6,28.96 14.6,25.91 14.73,25.78
VIN
  Top 0.61: Q2.3 47.65,11.96 48.89,13.21 48.89,22.84 | 48.89,22.84 VR1.3 | SJ1.2 27.05,30.23 28.32,31.5 35.69,31.5 37.72,29.46 40.77,29.46 41.78,28.45 47.37,28.45 48.89,26.92 48.89,22.84

### Text on the board
tDocu: HM10 | + | + | +5V | max 5A | GND | +V PUMP | - | + | + | max 500mA | GND | - | + | +V LASER | C6..C11 | GND | S | + | - | S | + | - | GND | Vin | GND | GrillUp | + | RESET | GND | +7-12V
bDocu: GrillUp